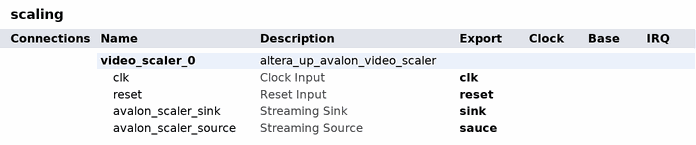
[diagram p0: system contents]
# Platform Designer (Qsys) system scaling, Cyclone IV E EP4CE115F29C7
# Parameters at their usual value, and those the tool derives, are not listed.
package require -exact qsys 18.0
create_system scaling
set_project_property DEVICE_FAMILY {Cyclone IV E}
set_project_property DEVICE EP4CE115F29C7

add_instance video_scaler_0 altera_up_avalon_video_scaler 18.0
set_instance_parameter_value video_scaler_0 color_bits 4
set_instance_parameter_value video_scaler_0 color_planes 3
set_instance_parameter_value video_scaler_0 height_scaling 2
set_instance_parameter_value video_scaler_0 width_in 320
set_instance_parameter_value video_scaler_0 width_scaling 2

# exported interfaces
add_interface clk clock sink
set_interface_property clk EXPORT_OF video_scaler_0.clk
add_interface reset reset sink
set_interface_property reset EXPORT_OF video_scaler_0.reset
add_interface sauce avalon_streaming source
set_interface_property sauce EXPORT_OF video_scaler_0.avalon_scaler_source
add_interface sink avalon_streaming sink
set_interface_property sink EXPORT_OF video_scaler_0.avalon_scaler_sink

set_interconnect_requirement {$system} qsys_mm.clockCrossingAdapter HANDSHAKE
set_interconnect_requirement {$system} qsys_mm.enableEccProtection FALSE
set_interconnect_requirement {$system} qsys_mm.insertDefaultSlave FALSE
set_interconnect_requirement {$system} qsys_mm.maxAdditionalLatency 1

save_system scaling.qsys
